# Altium project encoder_breakout.PrjPCB
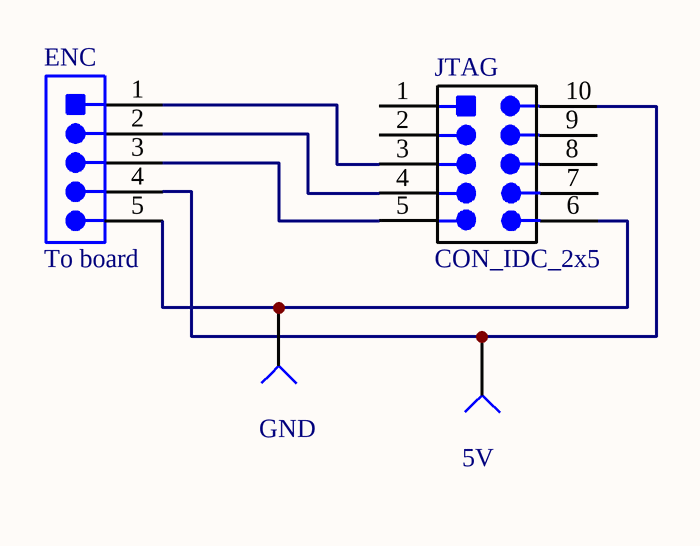
[diagram p0: encoder_breakout.SchDoc]
1 sheet, 4 parts. Net scope: global (net labels, ports and power ports of the same name join across sheets).
Board file: encoder_breakout.PcbDoc

## Sheet encoder_breakout.SchDoc
size A4

### Parts
ENC  To board  [JST-S5B-SM4-TB]
JTAG  CON_IDC_2x5  [IDC HEADER]
TP1  GND  [TESTPOINT]
TP2  5V  [TESTPOINT]

### Nets
NetENC_1: ENC.1 JTAG.3
NetENC_2: ENC.2 JTAG.4
NetENC_3: ENC.3 JTAG.5
NetENC_4: ENC.4 JTAG.10 TP2.1(=value)
NetENC_5: ENC.5 JTAG.6 TP1.1(=value)

Not connected (* = marked no-connect by the designer): JTAG 1 2 7 8 9

### Library data of the parts
ENC = CON_5M
TP1 TP2 = *: TESTPOINT_SMD; Part Number (MPN): *